# Altium schematic sheet main.SchDoc
size A; SheetNumber: 1; SheetTotal: 1
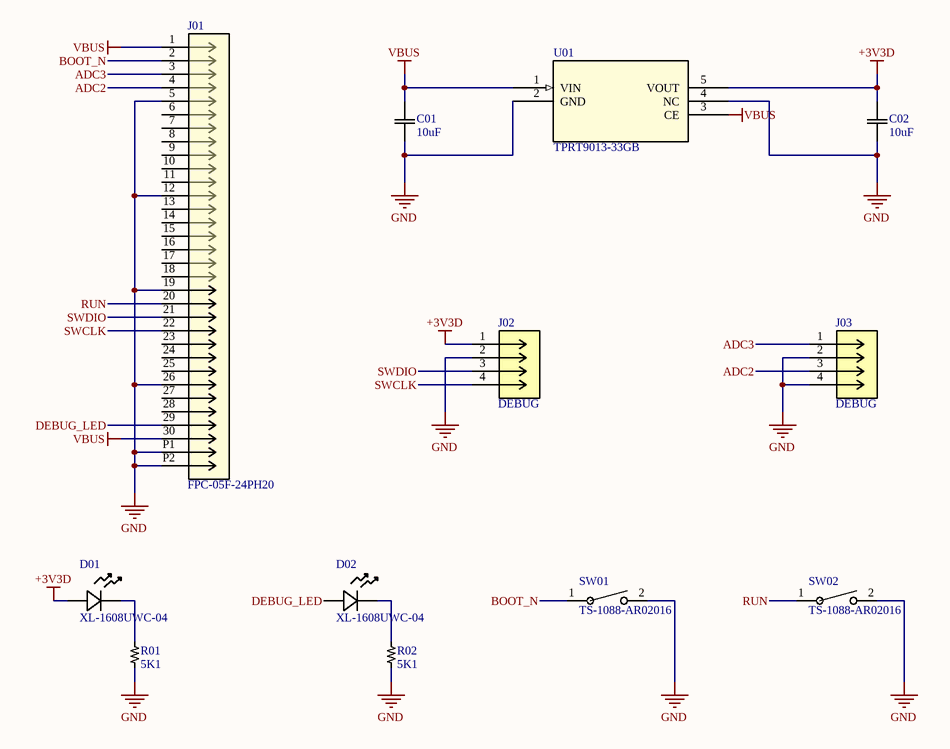
[diagram p0: main.SchDoc]

## Parts
C01  10uF  [CAPC10555_55N_KEM]
C02  10uF  [CAPC10555_55N_KEM]
D01  XL-1608UWC-04  [LED_XL-1608_XLG]
D02  XL-1608UWC-04  [LED_XL-1608_XLG]
J01  FPC-05F-24PH20  [FPC-05F-30PH20]
J02  DEBUG  [SW_Debugger_4P]
J03  DEBUG  [SW_Debugger_4P]
R01  5K1  [RES0402_CPF_TYCO_TYC]
R02  5K1  [RES0402_CPF_TYCO_TYC]
SW01  TS-1088-AR02016  [SW_TS-1088_XNP]
SW02  TS-1088-AR02016  [SW_TS-1088_XNP]
U01  TPRT9013-33GB  [SOT23-5_TCP]

## Nets
+3V3D: C02.2 D01.2(ANODE) J02.1 U01.5(VOUT)
GND: C01.1 C02.1 J01.5 J01.12 J01.19 J01.26 J01.P1 J01.P2 J02.2 J03.2 J03.4 R01.2 R02.2 SW01.2 SW02.2 U01.2(GND) U01.4(NC)
VBUS: C01.2 J01.1 J01.30 U01.1(VIN) U01.3(CE)
ADC2: J01.4 J03.3
ADC3: J01.3 J03.1
BOOT_N: J01.2 SW01.1
DEBUG_LED: D02.2(ANODE) J01.29
RUN: J01.20 SW02.1
SWCLK: J01.22 J02.4
SWDIO: J01.21 J02.3
NetD01_1: D01.1(CATHODE) R01.1
NetD02_1: D02.1(CATHODE) R02.1

Not connected (* = marked no-connect by the designer): J01 6 7 8 9 10 11 13 14 15 16 17 18 23 24 25 27 28

## Library data of the parts
C01 C02 = C0402: SMD Comm X7R, Ceramic, SMD, MLCC, Temperature Stable, 0402; Manufacturer_Name: Kemet; Manufacturer_Part_Number: C0402C104K4RACTU; Copyright: Copyright (C) 2025 Ultra Librarian. All rights reserved.; Datasheet: https://content.kemet.com/datasheets/KEM_C1002_X7R_SMD.pdf
D01 D02 = XL-1608UWC-04: No Description Available; Manufacturer_Name: XINGLIGHT; Copyright: Copyright (C) 2025 Ultra Librarian. All rights reserved.; Manufacturer_Part_Number: XL-1608UWC-04
J01 = FPC-05F-32PH20: 32 Pin 0.5 Pitch FPC connector
J02 J03 = DEBUG_4: Back up plan for debugging
R01 R02 = R0402: CPF 0402 RL; Manufacturer_Name: TE Connectivity; Manufacturer_Part_Number: CPF0402B33RE1; Copyright: Copyright (C) 2025 Ultra Librarian. All rights reserved.; Datasheet: https://www.te.com/commerce/DocumentDelivery/DDEController?Action=srchrtrv&DocNm=1773200&DocType=Data+Sheet&DocLang=English&PartCntxt=1-1879208-3&DocFormat=pdf
SW01 SW02 = TS-1088-AR02016: Description; Manufacturer_Name: Xunpu; Copyright: Copyright (C) 2026 Ultra Librarian. All rights reserved.; Manufacturer_Part_Number: TS-1088-AR02016
U01 = TPRT9013-33GB: No Description Available; Manufacturer_Name: Tech Public; Type: Power Management; Copyright: Copyright (C) 2025 Ultra Librarian. All rights reserved.; Manufacturer_Part_Number: TPRT9013-33GB; RefDes: RefDes